# EAGLE schematic Automatic-Garden-Waterer (EAGLE 6.2)
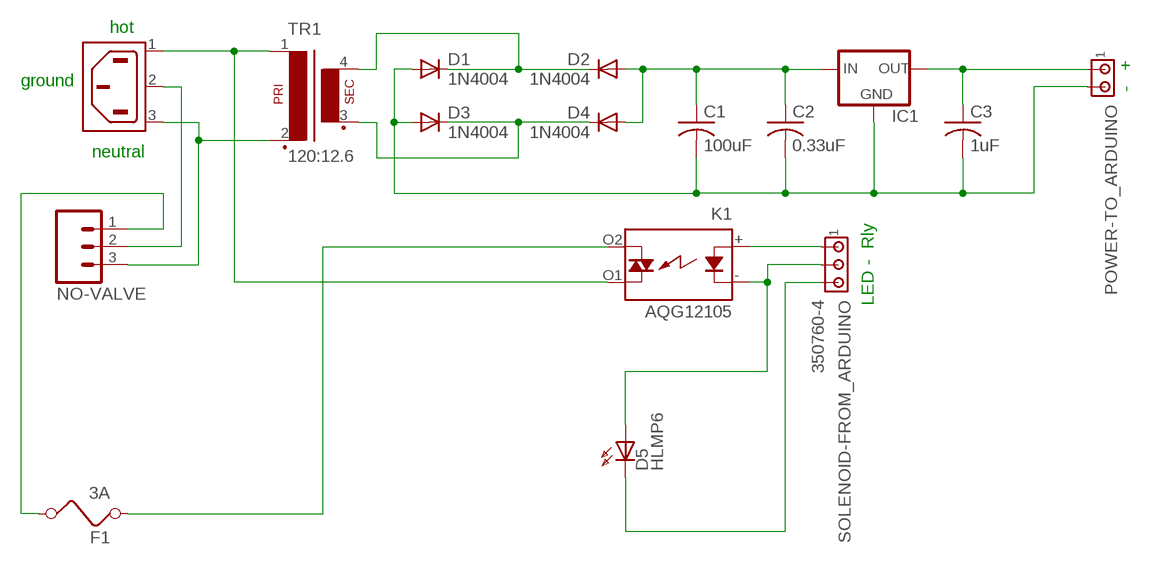
[diagram p0: schematic, sheet 1]

## Parts
C1  100uF  C-US075-032X103  [C075-032X103]
C2  0.33uF  C-US075-032X103  [C075-032X103]
C3  1uF  C-US075-032X103  [C075-032X103]
D1  1N4004  [DO41-10]
D2  1N4004  [DO41-10]
D3  1N4004  [DO41-10]
D4  1N4004  [DO41-10]
D5  HLMP6  [HLMP6]
F1  3A  FUSE  [FUSE]
IC1  V_REG_78XXSIDE  [78XXL]
K1  AQG12105  [AQG]
NO-VALVE  M03PTH  [1X03]
POWER-TO_ARDUINO  MTA02-100  [10X02MTA]
SOLENOID-FROM_ARDUINO  350760-4  [350760-4]
TR1  120:12.6  VP31  [VP31]
X1  6ESRM-P  [6ESRM-P]

## Nets
N$1: C3.1 IC1.OUT POWER-TO_ARDUINO.1
N$2: NO-VALVE.3 TR1.2 X1.3(AC2)
N$3: D1.C D2.C TR1.4(S4)
N$4: D3.C D4.C TR1.3(S3)
N$5: D5.K SOLENOID-FROM_ARDUINO.3
N$6: K1.O1(DS2) TR1.1 X1.1(AC1)
N$7: K1.+(A) SOLENOID-FROM_ARDUINO.1
N$8: D5.A K1.-(K) SOLENOID-FROM_ARDUINO.2
N$9: C1.1 C2.1 D2.A D4.A IC1.IN
N$10: NO-VALVE.2 X1.2(SH)
N$12: F1.1 K1.O2(DS1)
N$13: F1.2 NO-VALVE.1
N$15: C1.2 C2.2 C3.2 D1.A D3.A IC1.GND POWER-TO_ARDUINO.2

## Notes on the sheet
- hot
- ground
- -   +
- neutral
- LED -  Rly

## Library data of the parts
C1-C3 = rcl:C-US: CAPACITOR, American symbol
D1-D4 = diode:1N4004: DIODE general purpose rectifier, 1 A
D5 = display-hp:HLMP6: LED 2mm horizontal; MF: AGILENT TECHNOLOGIES; MPN: HLMP-6500; OC_FARNELL: 1652490; OC_NEWARK: 40K0088
F1 = special:FUSE: FUSE 5 x 20 mm
IC1 = SparkFun:V_REG_78XX: Voltage Regulator Standard 7805 5V regulator. IGO (Input Ground Output). Spark Fun Electronics SKU : COM-00107
K1 = relay:AQG*: SOLID STATE RELAY NAiS Zero-cross, Non zero-cross Source: http://www.mew-europe.com/.. en_ds_61611_0000.pdf; MF: AROMAT/ MATSUSHITA; MPN: AQG12105; OC_FARNELL: unknown; OC_NEWARK: 20J4759
NO-VALVE = SparkFun:M03: Header 3 Standard 3-pin 0.1" header. Use with straight break away headers (SKU : PRT-00116), right angle break away headers (PRT-00553), swiss pins (PRT-00743), machine pins (PRT-00117), and female headers (PRT-00115). Molex polarized connector foot print use with SKU : PRT-08232 with associated crimp pins and housings.
POWER-TO_ARDUINO = con-amp:MTA02-100: AMP connector
SOLENOID-FROM_ARDUINO = con-amp:350760-4: Universal MATE-N-LOK .250" Centerline, 600 V, 19 - 36 A max Source: http://catalog.tycoelectronics.com/ .. ENG_CD_350760_T.pdf
TR1 = trafo:VP31: TRANSFORMER 1 primary winding, 1 secondary winding BLOCK
X1 = con-tycoelectronics:6ESRM-P: AC Connector 120/250 VAC Source: http://catalog.tycoelectronics.com .. ENG_DS_1654001_1099_SR_0406.pdf; MF: TYCO ELECTRONICS; MPN: 6ESRM-P; OC_FARNELL: unknown; OC_NEWARK: 87F1821